# Altium schematic sheet CAN.SchDoc: Title
size A4; Project: Q24 VCU; ENG_APP_DATE: --/--/--; DSN_APP_DATE: --/--/--; CHK_APP_DATE: --/--/--; Date: *******; ApprovedBy: *******; CheckedBy: None; Author: *******; CompanyName: *******; DrawnBy: Jacob Chisholm; Engineer: *******; Organization: *******; Address1: *******; Address2: *******; Address3: *******; Address4: *******; DocumentNumber: 3; Revision: *******; SheetNumber: 3; SheetTotal: 14; Address_Website: https://jchisholm204.github.io; E-Mail: JacobChisholm1010@gmail.com; CurrentTime: *******; CurrentDate: *******; Time: *******; DocumentFullPathAndName: *******; DocumentName: *******; ModifiedDate: *******; ImagePath: *******; ProjectName: *******; Application_BuildNumber: *******
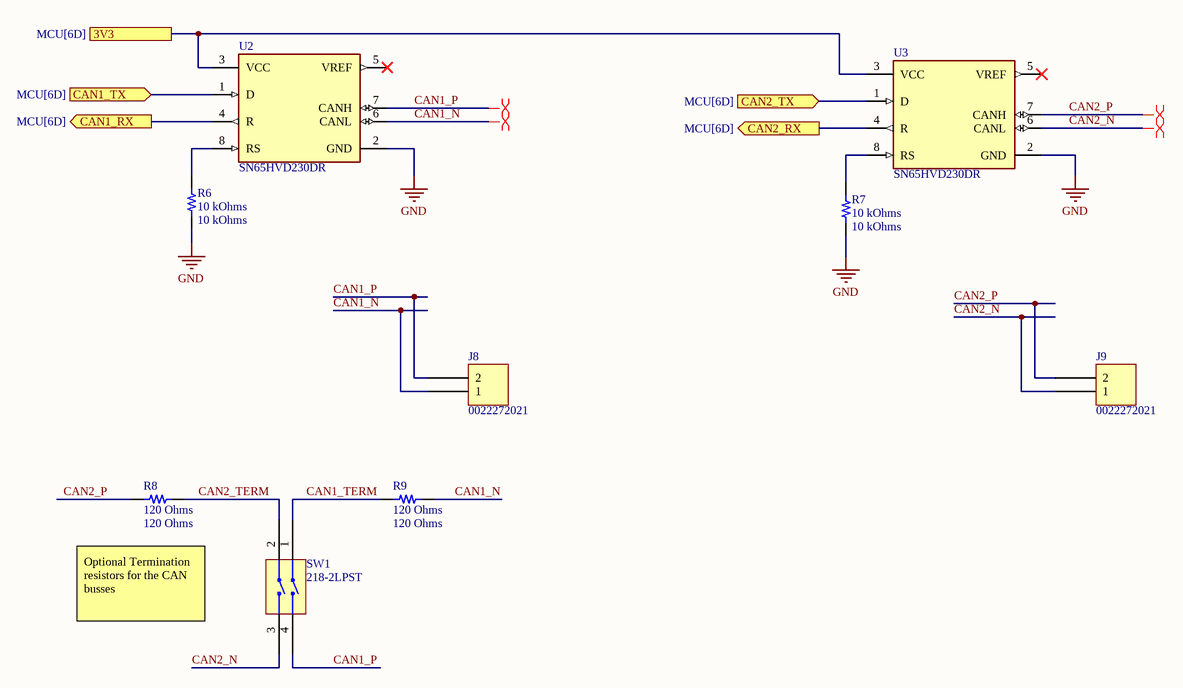
[diagram p0: CAN.SchDoc]

## Parts
J8  0022272021  [MOLEX KK 0022272021]
J9  0022272021  [MOLEX KK 0022272021]
R6  10 kOhms  [RES 0603_1608]
R7  10 kOhms  [RES 0603_1608]
R8  120 Ohms  [RES 0603_1608]
R9  120 Ohms  [RES 0603_1608]
SW1  218-2LPST  [CTS 218-2LPJ]
U2  SN65HVD230DR  [FP-D0008A-IPC_A]
U3  SN65HVD230DR  [FP-D0008A-IPC_A]

## Ports
3V3 (see MCU[6D]), CAN1_RX (out, see MCU[6D]), CAN1_TX (in, see MCU[6D]), CAN2_RX (out, see MCU[6D]), CAN2_TX (in, see MCU[6D])

## Nets
GND: R6.1 R7.1 U2.2(GND) U3.2(GND)
3V3: U2.3(VCC) U3.3(VCC) ; port 3V3
CAN1_N: J8.1 R9.2 U2.6(CANL)
CAN1_P: J8.2 SW1.4(GND) U2.7(CANH)
CAN1_RX: U2.4(R) ; port CAN1_RX
CAN1_TERM: R9.1 SW1.1(GND)
CAN1_TX: U2.1(D) ; port CAN1_TX
CAN2_N: J9.1 SW1.3(GND) U3.6(CANL)
CAN2_P: J9.2 R8.1 U3.7(CANH)
CAN2_RX: U3.4(R) ; port CAN2_RX
CAN2_TERM: R8.2 SW1.2(GND)
CAN2_TX: U3.1(D) ; port CAN2_TX
NetR6_2: R6.2 U2.8(RS)
NetR7_2: R7.2 U3.8(RS)

Not connected (* = marked no-connect by the designer): U2 5(VREF)*; U3 5(VREF)*

## Layout directives
differential pair: CAN1_N, CAN1_P, CAN2_N, CAN2_P

## Notes on the sheet
- Optional Termination resistors for the CAN busses
- Title:
- Drawn By:
- Page Contents:
- Checked By:
- Size:
- Date:
- File:
- License:
- Email:
- A4
- Number:
- Time:
- Revision:
- Sheet
- Website:
- of

## Library data of the parts
J8 J9 = 0022272021: CONN HEADER VERT 2POS 2.54MM; Part Number: 0022272021
R6 R7 = AA0603FR-0710KL: RES SMD 10K OHM 1% 1/10W 0603; Part Number: AA0603FR-0710KL; Value: 10 kOhms
R8 R9 = ERA-3AEB121V: RES SMD 120 OHM 0.1% 1/10W 0603; Part Number: ERA-3AEB121V; Value: 120 Ohms
SW1 = 218-2LPST: SWITCH SLIDE DIP SPST 25MA 24V; Part Number: 218-2LPST
U2 U3 = CMP-0315-00015-3: IC TRANSCEIVER HALF 1/1 8SOIC; Number of Transceivers: 1; Operating Supply Voltage: 3.3V; Number of I/Os: 2; Max Supply Current: 17mA; Max Supply Voltage: 3.6V; Min Supply Voltage: 3V; Data Rate: 1Mbps; Min Operating Temperature: -40°C; Packaging: Tape and Reel; Lead Free: Lead Free; Number of Transmit Buffers: 1; Max Operating Temperature: 85°C; Number of Receive Buffers: 1; Number of Pins: 8; Package Quantity: 1; Radiation Hardening: No; Case/Package: D; REACH SVHC: No SVHC; Weight: 0.002561oz; Termination: SMD/SMT; Contact Plating: Gold; Nominal Supply Current: 17mA; Number of Receivers: 1; Number of Drivers: 1